# Altium schematic sheet Microcontroller.SchDoc: Microcontroller
size Letter; Author: Alfredo Cortellini; Organization: IT Logic; Address1: 5753 Highway 85 N; Address2: Crestview, FL 32536; Address3: United States; DocumentNumber: 4; SheetNumber: 4; SheetTotal: 6; Email: pcb-design@itlogic.cloud
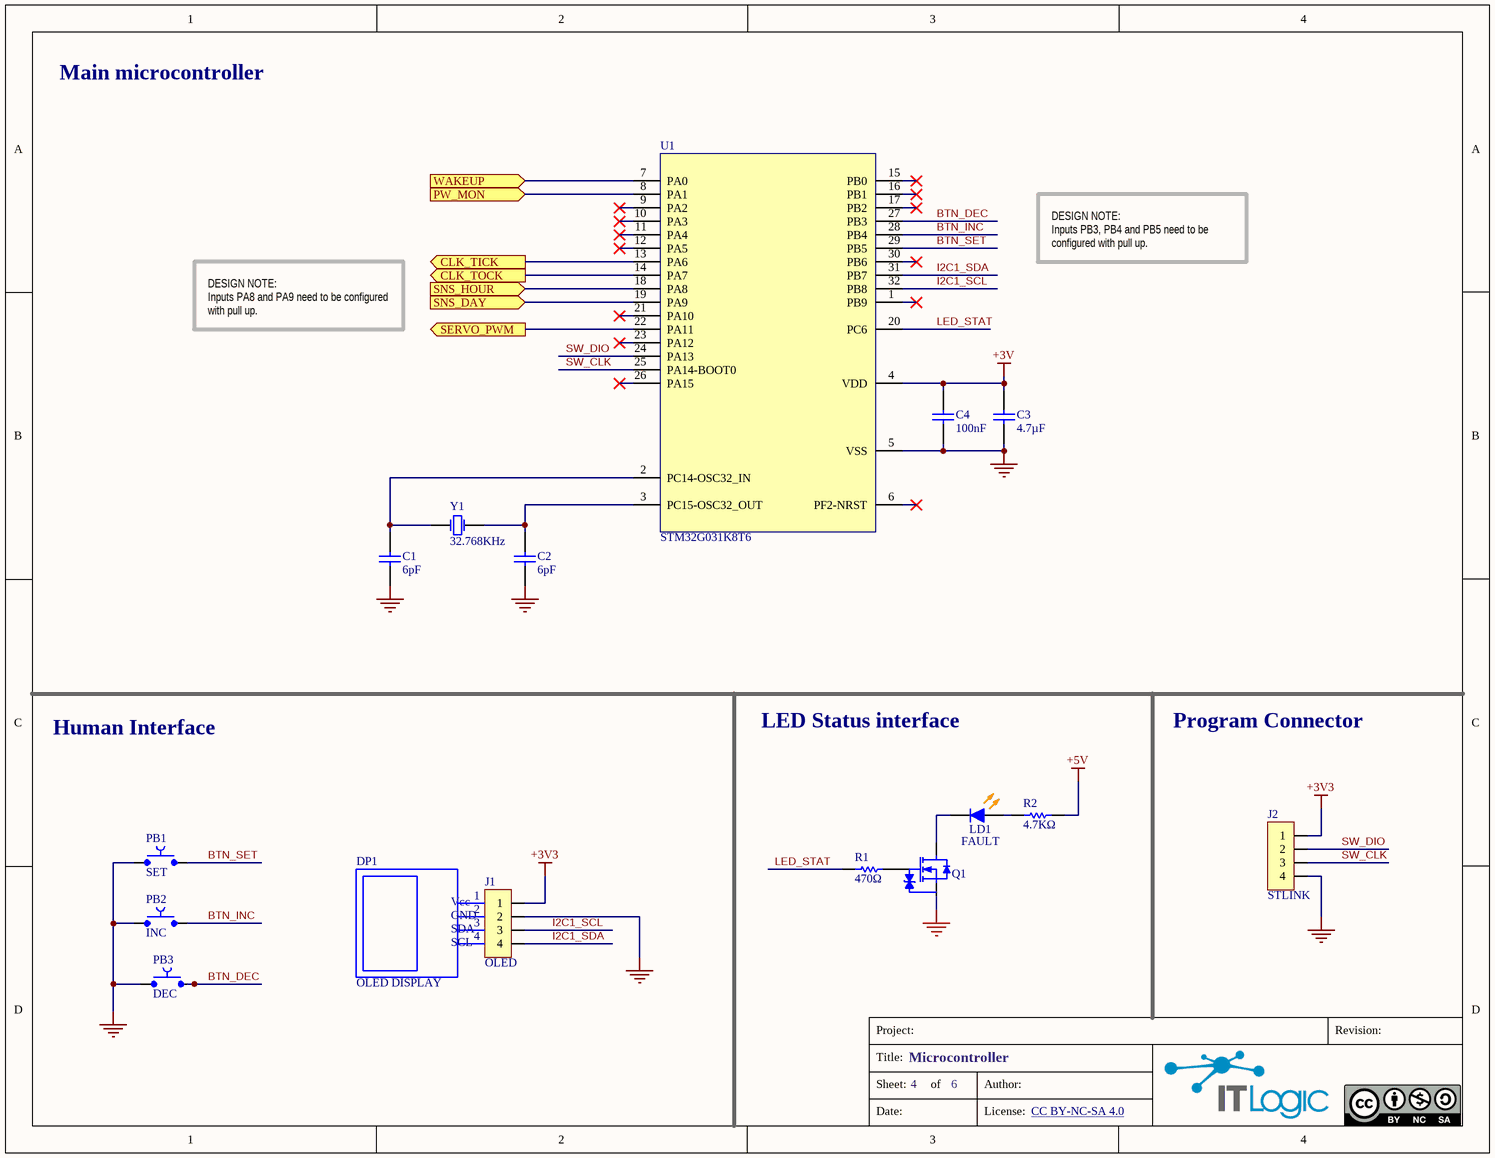
[diagram p0: Microcontroller.SchDoc]

## Parts
C1  6pF  [C0603-H90]
C2  6pF  [C0603-H90]
C3  4.7µF  [C0603-H90]
C4  100nF  [C0603-H90]
DP1  OLED DISPLAY  (mechanical)
J1  OLED  [SSQ-104-01-S-BOTTOM]
J2  STLINK  [HDR-V-1R-04P-5.8L]
LD1  FAULT  [LED-0805-O]
PB1  SET  [BUT-1-1825027-1-BOTTOM]
PB2  INC  [BUT-1-1825027-1-BOTTOM]
PB3  DEC  [BUT-1-1825027-1-BOTTOM]
Q1  BSS138K-13  [SOT-23]  (value not drawn)
R1  470Ω  [R0603-H55]
R2  4.7KΩ  [R0603-H55]
U1  STM32G031K8T6  [LQFP32-7X7-P080]
Y1  32.768KHz  [XTAL-ABM6]

## Ports
CLK_TICK (out), CLK_TOCK (out), PW_MON (in), SERVO_PWM (out), SNS_DAY (in), SNS_HOUR (in), WAKEUP (in)

## Nets
+3V: C3.2 C4.2 U1.4(VDD)
+3V3: J1.1 J2.1
+5V: R2.2
GND: C1.1 C2.1 C3.1 C4.1 J1.2 J2.4 PB1.1 PB2.1 PB3.1 Q1.2(S) U1.5(VSS)
BTN_DEC: PB3.2 U1.27(PB3)
BTN_INC: PB2.2 U1.28(PB4)
BTN_SET: PB1.2 U1.29(PB5)
CLK_TICK: U1.13(PA6) ; port CLK_TICK
CLK_TOCK: U1.14(PA7) ; port CLK_TOCK
I2C1_SCL: J1.3 U1.32(PB8)
I2C1_SDA: J1.4 U1.31(PB7)
LED_STAT: R1.1 U1.20(PC6)
PW_MON: U1.8(PA1) ; port PW_MON
SERVO_PWM: U1.22(PA11) ; port SERVO_PWM
SNS_DAY: U1.19(PA9) ; port SNS_DAY
SNS_HOUR: U1.18(PA8) ; port SNS_HOUR
SW_CLK: J2.3 U1.25(PA14-BOOT0)
SW_DIO: J2.2 U1.24(PA13)
WAKEUP: U1.7(PA0) ; port WAKEUP
NetC1_2: C1.2 U1.2(PC14-OSC32_IN) Y1.1(X1)
NetC2_2: C2.2 U1.3(PC15-OSC32_OUT) Y1.2(X2)
NetLD1_1: LD1.1(K) Q1.3(D)
NetLD1_2: LD1.2(A) R2.1
NetQ1_1: Q1.1(G) R1.2

Not connected (* = marked no-connect by the designer): U1 1(PB9)* 6(PF2-NRST)* 9(PA2)* 10(PA3)* 11(PA4)* 12(PA5)* 15(PB0)* 16(PB1)* 17(PB2)* 21(PA10)* 23(PA12)* 26(PA15)* 30(PB6)*

## Notes on the sheet
- Main microcontroller
- DESIGN NOTE:
  Inputs PB3, PB4 and PB5 need to be configured with pull up.
- DESIGN NOTE:
  Inputs PA8 and PA9 need to be configured with pull up.
- Human Interface
- LED Status interface
- Program Connector
- Project:
- Revision:
- Title:
- Sheet:
- of
- Author:
- Date:
- License:
- CC BY-NC-SA 4.0 <https://creativecommons.org/licenses/by-nc-sa/4.0/>
- (in symbol MC096VW) 1; Vcc; 2; GND; 3; SDA; 4; SCL

## Library data of the parts
C1 C2 = CGA3E2C0G1H060D080AA: Cap 0603 Case Ceramic 6pF 50V C0G; Manufacturer: TDK; Value: 6p; Manufacturer Part Number: CGA3E2C0G1H060D080AA; Mount: Surface Mount; Case: 0603; Capacitance: 6pF; Dielectric: C0G; Voltage Rating: 50V; ComponentLink1URL: https://product.tdk.com/system/files/dam/doc/product/capacitor/ceramic/mlcc/catalog/mlcc_automotive_general_en.pdf; ComponentLink1Description: Data Sheet
C3 = C1608X7S1A475K080AC: Cap 0603 Case Ceramic 4.7uF 10V X7S; Manufacturer: TDK; Voltage Rating: 50V; Value: 4.7u; Manufacturer Part Number: C1608X7S1A475K080AC; Mount: Surface Mount; Case: 0603; Capacitance: 4.7uF; Dielectric: X7S; ComponentLink1URL: https://product.tdk.com/system/files/dam/doc/product/capacitor/ceramic/mlcc/catalog/mlcc_commercial_general_en.pdf; ComponentLink1Description: Data Sheet
C4 = CGA3E2X7R1H104K080AA: Cap 0603 Case Ceramic 100nF 50V X7R; Manufacturer: TDK; Value: 100n; Manufacturer Part Number: CGA3E2X7R1H104K080AA; Mount: Surface Mount; Case: 0603; Capacitance: 100nF; Dielectric: X7R; Voltage Rating: 50V; ComponentLink1URL: https://product.tdk.com/system/files/dam/doc/product/capacitor/ceramic/mlcc/catalog/mlcc_commercial_general_en.pdf; ComponentLink1Description: Data Sheet
DP1 = MC096VW: Oled Module, 0.96inch, I2C Interface; Manufacturer: Hiletgo; Voltage Rating: 5V; Manufacturer Part Number: MC096VW; Mount: Through Hole; ComponentLink1URL: https://datasheet.ciiva.com/2/crseries-datasheets-merged-2903.pdf; ComponentLink1Description: Data Sheet
J1 = SSQ-104-01-T-S: Conn Post Socket Header Vert - 1 Row - 4 Pos - 3 mm Lenght - Tin; Manufacturer: Samtec; Current Rating: 3A; Manufacturer Part Number: SSQ-104-01-T-S; Mount: Through Hole; ComponentLink1URL: https://datasheet.ciiva.com/717/eng-cd-146256-g-146256-c-dwg-717712.pdf; ComponentLink1Description: Data Sheet
J2 = 22-28-4043: Breakaway Header Vert - 1 Row - 4 Pos - 6 mm Lenght - Gold; Manufacturer: Molex; Current Rating: 4A; Voltage Rating: 250V; Manufacturer Part Number: 22-28-4043; Mount: Through Hole; ComponentLink1URL: https://datasheet.ciiva.com/6814/022284363-sd-6814049.pdf; ComponentLink1Description: Data Sheet
LD1 = LTST-C170KFKT: LED 0805 Top Orange 605nm 2-Pin; Manufacturer: Vishay Lite-On; Manufacturer Part Number: LTST-C170KFKT; Mount: Surface Mount; Case: 0805; ComponentLink1URL: https://www.mouser.com/datasheet/2/239/Lite-On-LTST-C170KFKT-1175423.pdf; ComponentLink1Description: Data Sheet
PB1-PB3 = 1-1825027-1: Tactile Switch, Round Stem, Color ivory, Lenght 5.74mm, Right Angle, Through Hole.; Manufacturer: TE Connectivity; Voltage Rating: 24V; Current Rating: 50 mA; Manufacturer Part Number: 1-1825027-1; Mount: Through Hole; ComponentLink1URL: https://www.mouser.com/datasheet/2/418/NG_CD_1825027_G4-659945.pdf; ComponentLink1Description: Data Sheet
Q1 = BSS138K-13: Mosfet N 50V Vds 20V Vgs ESD 1.4R SOT-23; Manufacturer: Diodes; Manufacturer Part Number: BSS138K-13; Mount: Surface Mount; Case: SOT-23; ComponentLink1Description: Data Sheet; ComponentLink1URL: https://www.diodes.com/assets/Datasheets/BSS138K.pdf
R1 = RC0603FR-07470RL: Resistor 0603 Case 470R 1% 1/10W; Manufacturer: Yageo; Voltage Rating: 150V; Value: 470; Manufacturer Part Number: RC0603FR-07470RL; Case: 0603; Resistance: 470R; ComponentLink1URL: https://datasheet.ciiva.com/11808/0900766b8106beab-11808155.pdf; ComponentLink1Description: Data Sheet; Mount: Surface Mount
R2 = RC0603FR-074K7L: Resistor 0603 Case 4.7KR 1% 1/10W; Manufacturer: Yageo; Voltage Rating: 150V; Value: 4.7K; Manufacturer Part Number: RC0603FR-074K7L; Case: 0603; Resistance: 4.7kR; ComponentLink1URL: https://datasheet.ciiva.com/11808/0900766b8106beab-11808155.pdf; ComponentLink1Description: Data Sheet; Mount: Surface Mount
U1 = STM32G031K8T6: STM32 Arm Cortex-M0+ MCU, 64 Kbytes Flash 8 Kbytes RAM, 64 MHz CPU, Package LQFP32; Manufacturer: STMicroelectronics; Frequency: 64MHz; Manufacturer Part Number: STM32G031K8T6; Mount: Surface Mount; Case: LQFP32; ComponentLink1URL: https://www.st.com/resource/en/datasheet/stm32g031k8.pdf; ComponentLink1Description: Data Sheet
Y1 = ABS06-32.768KHZ-6-1-T: Quartz 32.768kHz ±10ppm Crystal 6pF 90 kOhm -40°C ~ 85°C  Surface Mount 2-SMD; Manufacturer: Abracon; Manufacturer Part Number: ABS06-32.768KHZ-6-1-T; Mount: Surface Mount; Frequency: 32.768kHz; ComponentLink1URL: https://datasheet.ciiva.com/15214/getdatasheetpartid-722402-15214953.pdf; ComponentLink1Description: Data Sheet; Value: 32.768K; Case: ABM6